# Altium schematic sheet [12] - POWER.SchDoc: POWER
size A4; Organization: Bjørn T. Brodtkorb; Address1: Frode Rinnans veg 161; Address2: 7050 Trondheim; DocumentNumber: 6598; Revision: 1.0; SheetNumber: 1; SheetTotal: 1
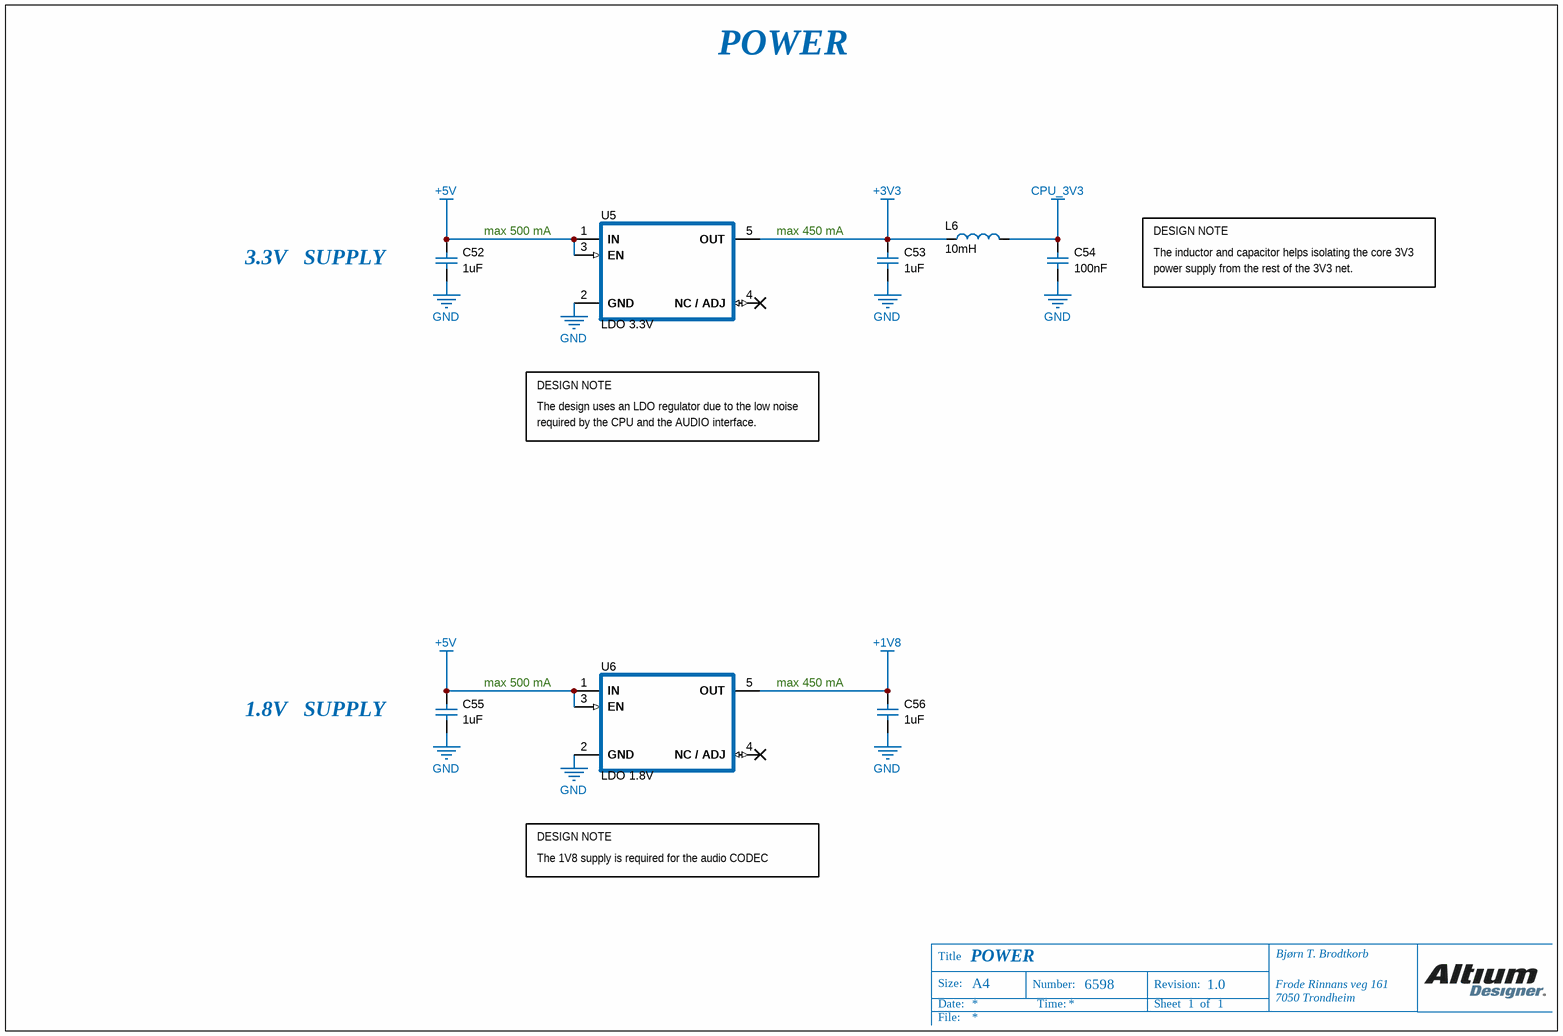
[diagram p0: [12] - POWER.SchDoc]

## Parts
C52  value 1uF  [C0805]  (hidden comment: 08053C105KAT2A)
C53  value 1uF  [C0805]  (hidden comment: 08053C105KAT2A)
C54  value 100nF  [C0603]  (hidden comment: 02016D104KAT2A)
C55  value 1uF  [C0805]  (hidden comment: 08053C105KAT2A)
C56  value 1uF  [C0805]  (hidden comment: 08053C105KAT2A)
L6  value 10mH  [Inductor 0603]  (hidden comment: MLZ1608A2R2WT)
U5  LDO 3.3V  [NCV8161BSN330T1G]
U6  LDO 1.8V  [SOT95P275X110-5N]

## Nets
+1V8: C56.2 U6.5(OUT)
+3V3: C53.2 L6.1 U5.5(OUT)
+5V: C52.2 C55.2 U5.1(IN) U5.3(EN) U6.1(IN) U6.3(EN)
CPU_3V3: C54.2 L6.2
GND: C52.1 C53.1 C54.1 C55.1 C56.1 U5.2(GND) U6.2(GND)

Not connected (* = marked no-connect by the designer): U5 4(NC_/_ADJ)*; U6 4(NC_/_ADJ)*

## Notes on the sheet
- POWER
- max 500 mA
- max 450 mA
- DESIGN NOTE
- 3.3V   SUPPLY
- The inductor and capacitor helps isolating the core 3V3
- power supply from the rest of the 3V3 net.
- The design uses an LDO regulator due to the low noise
- required by the CPU and the AUDIO interface.
- 1.8V   SUPPLY
- The 1V8 supply is required for the audio CODEC
- Title
- Size:
- A4
- Number:
- Revision:
- Date:
- File:
- Time:
- Sheet
- of

## Library data of the parts
C52 C53 C55 C56 = 08053C105KAT2A: C0805
C54 = 02016D104KAT2A: C0603
L6 = MLZ1608A2R2WT: Inductor 0603
U5 = NCV8161BSN330T1G: LDO fixed 3.3V 450mA ultra-low noise; RMS noise: < 100 uVrms; Dropout voltage: 330mV; Supplier Part Number 1: 2775470; Supplier 1: Farnell; Output voltage: 3.3V; Output current: 450mA
U6 = NCV8161ASN180T1G: LDO fixed 1.8V 450mA ultra-low noise; Dropout voltage: 200mV; Supplier 1: Farnell; Output voltage: 1.8V; Supplier Part Number 1: 2775471; Output current: 450mA